# Altium schematic sheet prg-flash.SchDoc
size A
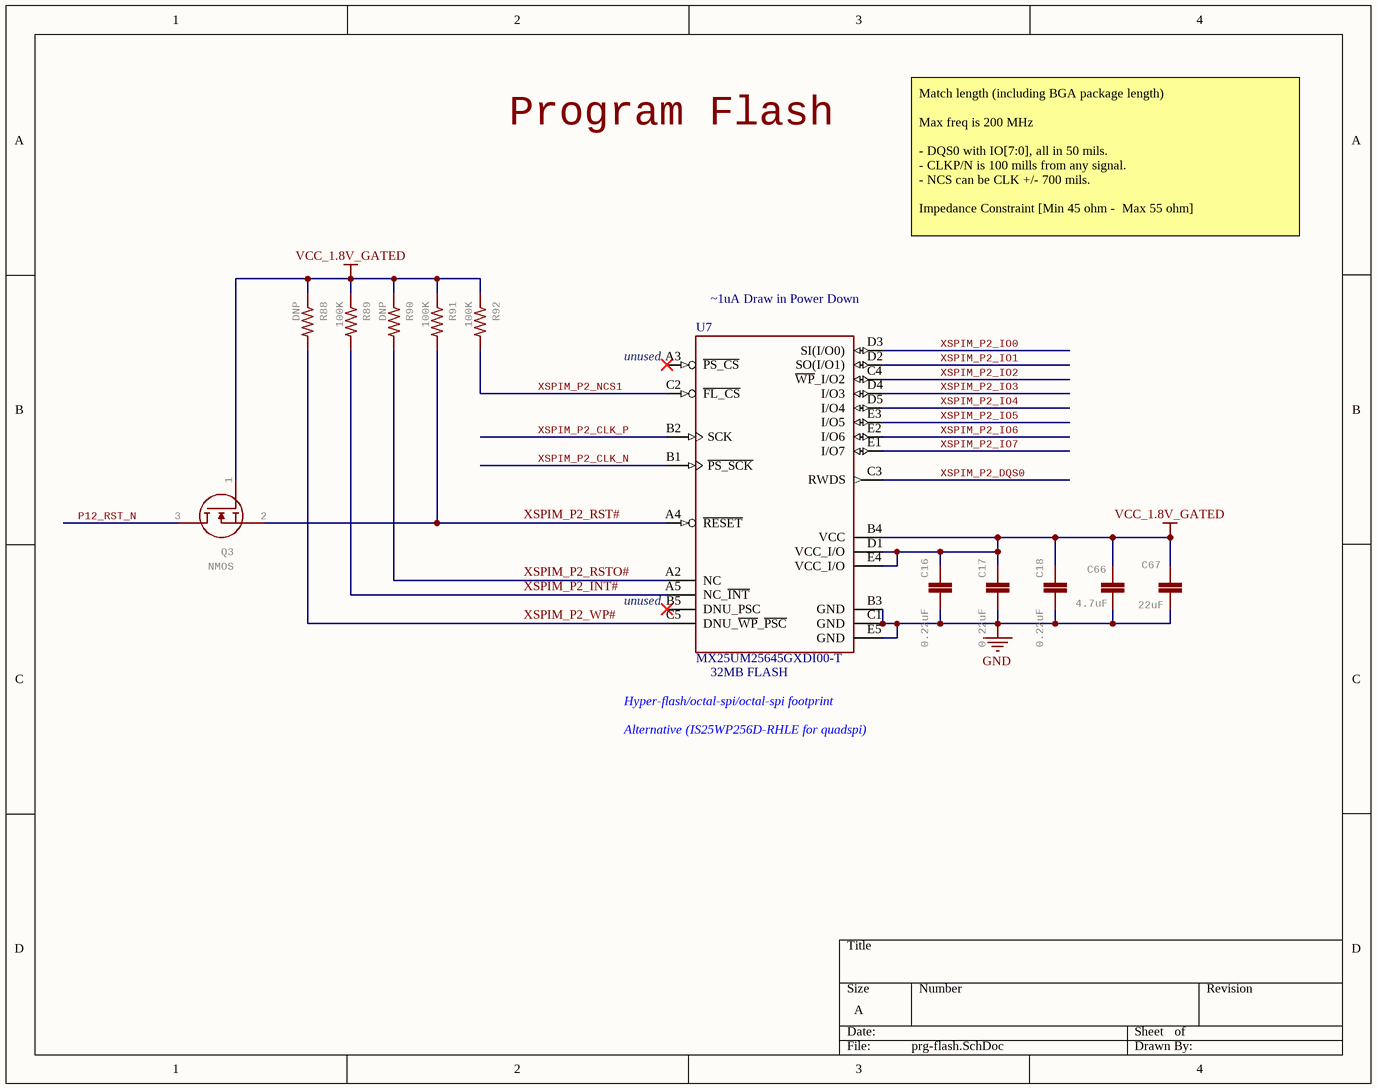
[diagram p0: prg-flash.SchDoc]

## Parts
C16  0.22uF  [C0201]
C17  0.22uF  [C0201]
C18  0.22uF  [C0201]
C66  4.7uF  [0402-CAP]
C67  22uF  [0805]
Q3  NMOS  [DFN1006]
R88  DNP  [0402-RES]
R89  100K  [0402-RES]
R90  DNP  [0402-RES]
R91  100K  [0402-RES]
R92  100K  [0402-RES]
U7  MX25UM25645GXDI00-T  [24-TBGA]

## Nets
GND: C16.2 C17.2 C18.2 C66.1 C67.1 U7.B3(GND) U7.C1(GND) U7.E5(GND)
VCC_1.8V_GATED: C16.1 C17.1 C18.1 C66.2 C67.2 Q3.1(G) R88.1 R89.1 R90.1 R91.1 R92.1 U7.B4(VCC) U7.D1(VCC_I/O) U7.E4(VCC_I/O)
P12_RST_N: Q3.3(D)
XSPIM_P2_CLK_N: U7.B1(~{PS_SCK})
XSPIM_P2_CLK_P: U7.B2(SCK)
XSPIM_P2_DQS0: U7.C3(RWDS)
XSPIM_P2_INT#: R89.2 U7.A5(NC_~{INT})
XSPIM_P2_IO0: U7.D3(SI(I/O0))
XSPIM_P2_IO1: U7.D2(SO(I/O1))
XSPIM_P2_IO2: U7.C4(~{WP}_I/O2)
XSPIM_P2_IO3: U7.D4(I/O3)
XSPIM_P2_IO4: U7.D5(I/O4)
XSPIM_P2_IO5: U7.E3(I/O5)
XSPIM_P2_IO6: U7.E2(I/O6)
XSPIM_P2_IO7: U7.E1(I/O7)
XSPIM_P2_NCS1: R92.2 U7.C2(~{FL_CS})
XSPIM_P2_RST#: Q3.2(S) R91.2 U7.A4(~{RESET})
XSPIM_P2_RSTO#: R90.2 U7.A2(NC)
XSPIM_P2_WP#: R88.2 U7.C5(DNU_~{WP}_~{PSC})

Not connected (* = marked no-connect by the designer): U7 A3(~{PS_CS})* B5(DNU_PSC)*

## Notes on the sheet
- Program Flash
- Match length (including BGA package length)
  Max freq is 200 MHz
  - DQS0 with IO[7:0], all in 50 mils.
  - CLKP/N is 100 mills from any signal.
  - NCS can be CLK +/- 700 mils.
  Impedance Constraint [Min 45 ohm -  Max 55 ohm]
- (near U7) ~1uA Draw in Power Down
- (near U7) unused
- (near U7) 32MB FLASH
- Hyper-flash/octal-spi/octal-spi footprint
- Alternative (IS25WP256D-RHLE for quadspi)

## Library data of the parts
C16-C18 = C-EUC0201: CAPACITOR, European symbol; MPN: GRM033R60J224ME15D; GateName_1: G$1; SymbolName_1: C-EU; POPULARITY: 0; DeviceName: C0201; LibraryName: rcl; DeviceSetName: C-EU; SPICEPREFIX: C; Part Number: GRM033R60J224ME15D
C66 = CAP0402-CAP: CapacitorStandard 0603 ceramic capacitor, and 0.1" leaded capacitor.; MPN: JMK105BBJ475MV-F; GateName_1: G$1; SymbolName_1: CAP; DeviceName: 0402-CAP; LibraryName: sfe; DeviceSetName: CAP; Part Number: JMK105BBJ475MV-F
C67 = 22UF-0805-6.3V-20%: 22ÂµF ceramic capacitors    A capacitor is a passive two-terminal electrical component used to store electrical energy temporarily in an electric field.; MPN: CL21A226MQQNNNE; GateName_1: G$1; SymbolName_1: CAP; PROD_ID: CAP-08402; DeviceName: -0805-6.3V-20%; LibraryName: SparkFun-Capacitors; DeviceSetName: 22UF; Part Number: CL21A226MQQNNNE
Q3 = 2N7002KW_R1_00001: GateName_1: G$1
R88 R90 = RESISTOR0402-RES: ResistorBasic schematic elements and footprints for 0603, 1206, and PTH resistors.; GateName_1: G$1; SymbolName_1: RESISTOR; DeviceName: 0402-RES; LibraryName: sfe; DeviceSetName: RESISTOR; MPN: DNP; Part Number: DNP
R89 R91 R92 = RESISTOR0402-RES: ResistorBasic schematic elements and footprints for 0603, 1206, and PTH resistors.; MPN: AC0402FR-07100KL; GateName_1: G$1; SymbolName_1: RESISTOR; DeviceName: 0402-RES; LibraryName: sfe; DeviceSetName: RESISTOR; Part Number: AC0402FR-07100KL
U7 = IS25WX256-JHLE: IC, Flash,32MB x 8, Octal SPI, Ind Temp, 1.8V,24-BGA; Part Number: MX25UM25645GXDI00-T; MPN: MX25UM25645GXDI00-T